# EasyEDA schematic SCH_vibrating-mamba-snake_2024-07-07 (1).json
TITLE: Sheet_1; REV: 1.0; Date: 2024-07-06; Sheet: 1/1; Drawn By: nikhilmansotragg; Company: Your Company
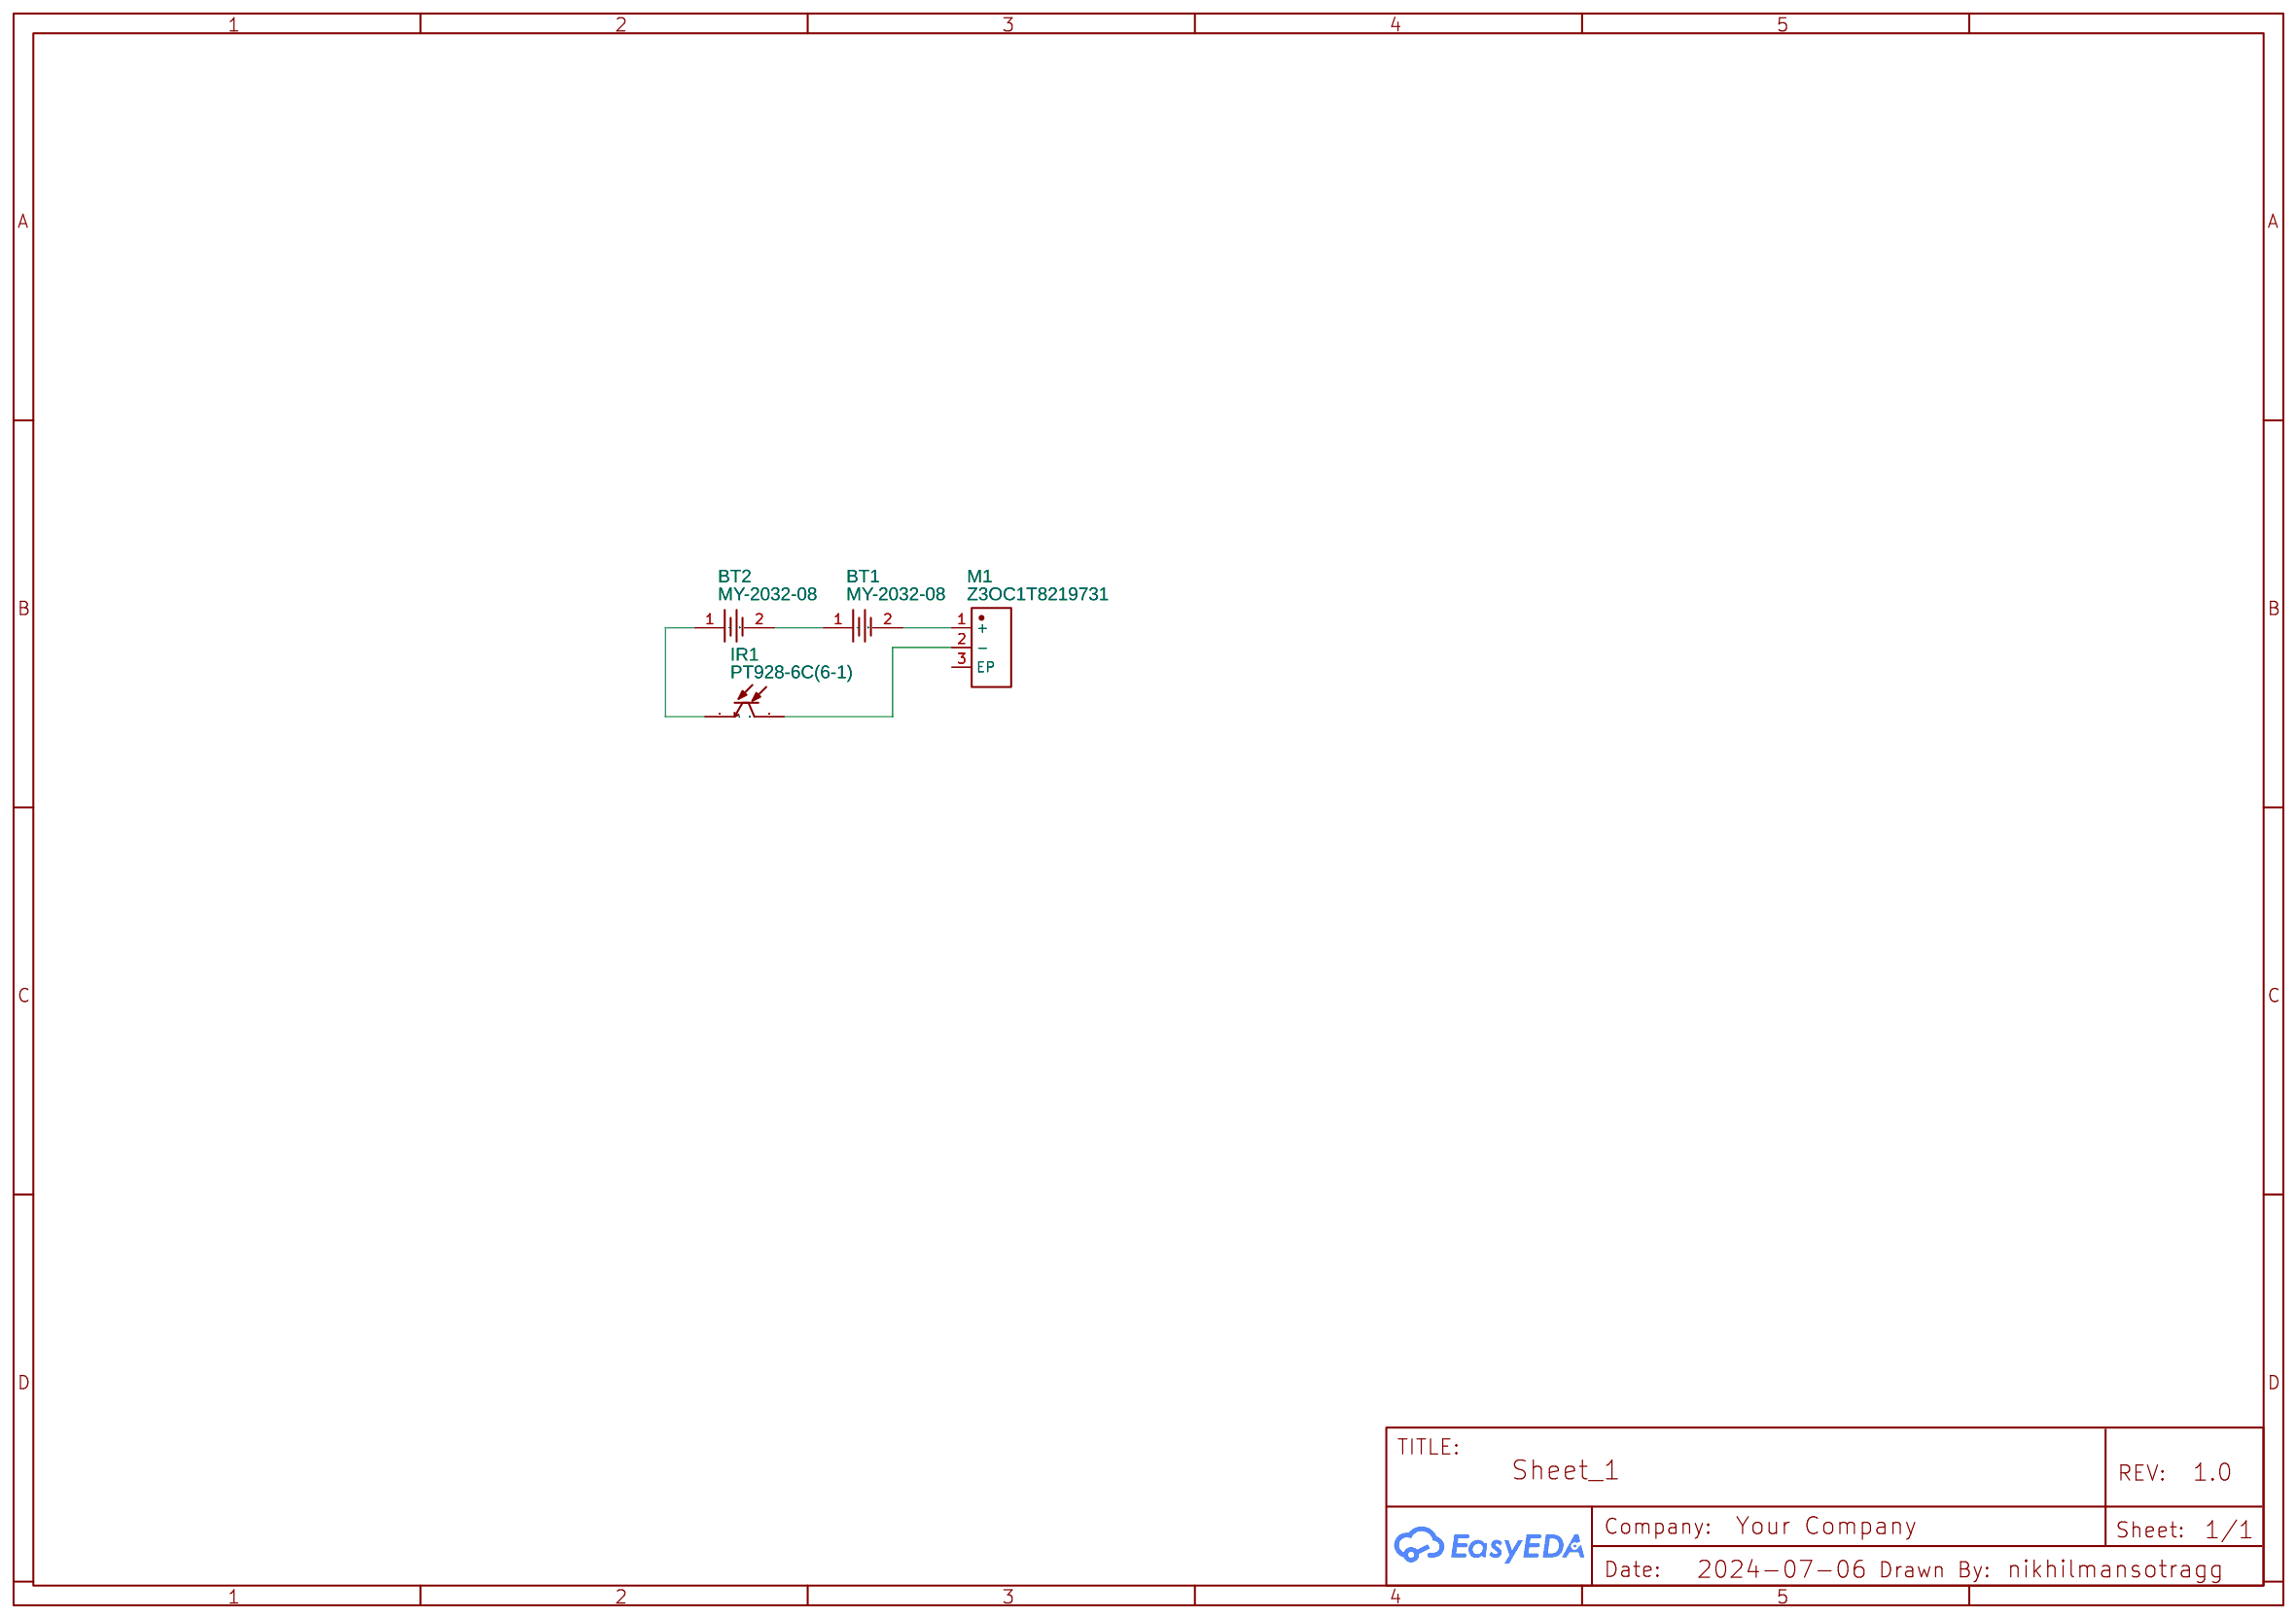
[diagram p0: schematic sheet]

## Parts
BT1  MY-2032-08  [BAT-SMD_MY-2032-08]
BT2  MY-2032-08  [BAT-SMD_MY-2032-08]
IR1  PT928-6C(6-1)  [LED-TH_L4.5-W1.5-P2.54-RD]
M1  Z3OC1T8219731  [VIBRATING-MOTOR-SMD_3P-C9900001680]

## Library data of the parts
BT1 BT2 = MY-2032-08: Contributor: LCSC; Supplier: LCSC; Supplier Part: C964831; Manufacturer: MYOUNG(美阳); JLCPCB Part Class: Extended Part
IR1 = PT928-6C(6-1): Supplier: LCSC; Manufacturer: EVERLIGHT(亿光); Supplier Part: C72049; JLCPCB Part Class: Extended Part
M1 = Z3OC1T8219731: Contributor: LCSC; Supplier: LCSC; Supplier Part: C2894731; Manufacturer: KOTL(金龙机电); JLCPCB Part Class: Extended Part

## Nets
Net-(BT1-1): BT1.1 BT2.2
Net-(BT1-2): BT1.2 M1.1(+)
Net-(BT2-1): BT2.1 IR1.1(E)
Net-(IR1-2): IR1.2(C) M1.2(-)

Not connected (* = marked no-connect by the designer): M1 3(EP)
